# EAGLE schematic layout (EAGLE 6.5.0)
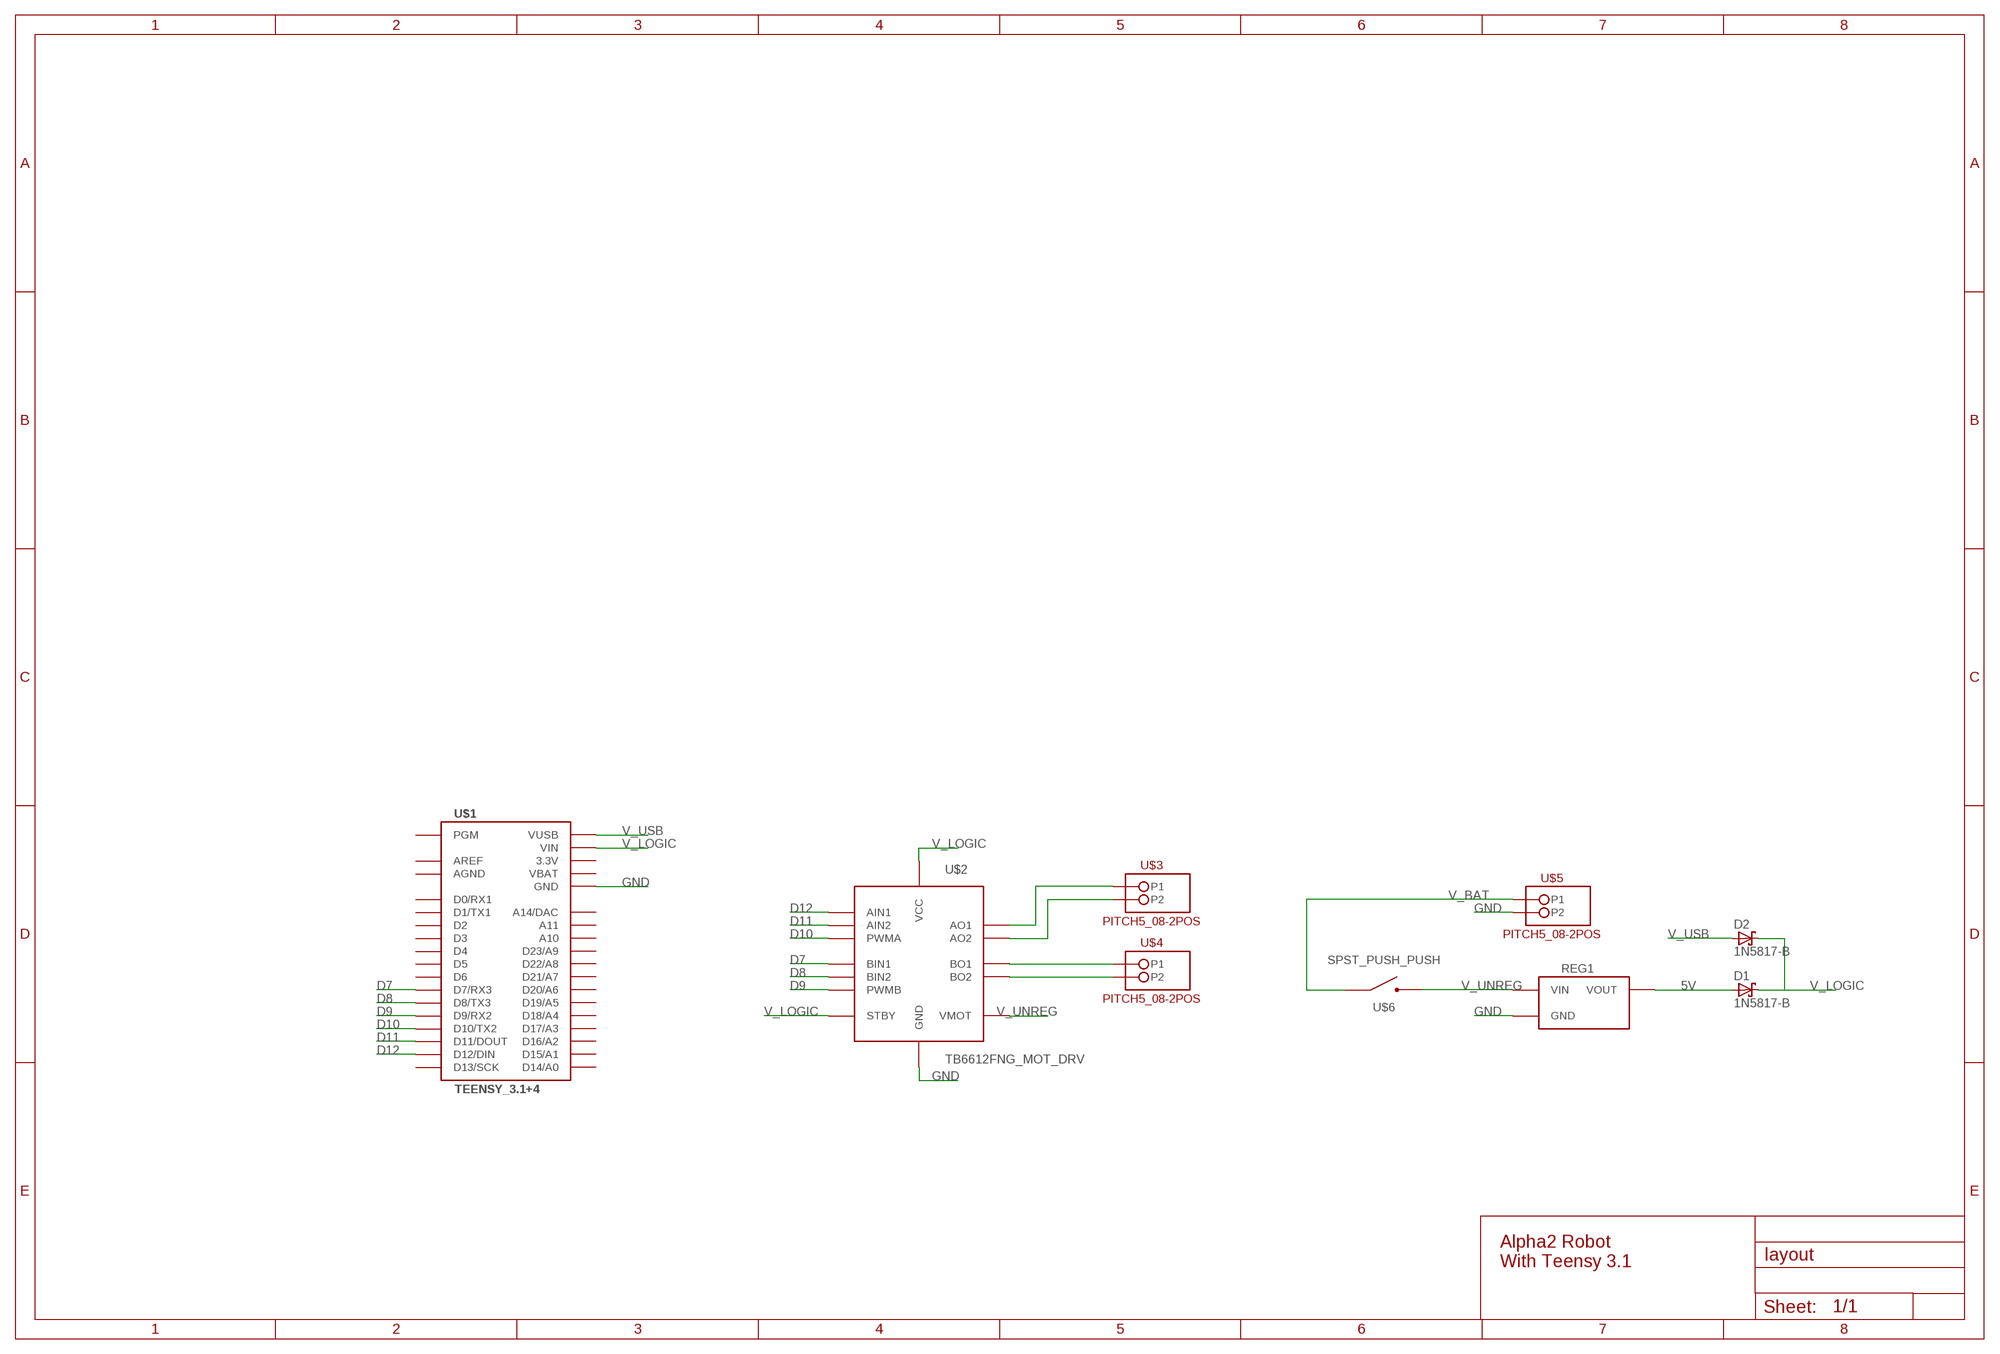
[diagram p0: schematic, sheet 1]

## Parts
D1  1N5817-B  [DO41-7.6]
D2  1N5817-B  [DO41-7.6]
REG1  VREG_POLOLU_2119_5V  [VREG-POLOLU_3PIN]
U$1  TEENSY_3.1+4  [TEENSY_3.1+4]
U$2  TB6612FNG_MOT_DRV  [TB6612FNG]
U$3  PITCH5_08-2POS  [PITCH5_08-2POS]
U$4  PITCH5_08-2POS  [PITCH5_08-2POS]
U$5  PITCH5_08-2POS  [PITCH5_08-2POS]
U$6  SPST_PUSH_PUSH  [SPST_PUSH_PUSH]

## Nets
5V: D1.A REG1.VOUT
D7: U$1.7(D7/RX3) U$2.P$5(BIN1)
D8: U$1.8(D8/TX3) U$2.P$6(BIN2)
D9: U$1.9(D9/RX2) U$2.P$7(PWMB)
D10: U$1.10(D10/TX2) U$2.P$1(PWMA)
D11: U$1.11(D11/DOUT) U$2.P$2(AIN2)
D12: U$1.12(D12/DIN) U$2.P$3(AIN1)
GND: REG1.GND U$1.GND U$1.GND1(GND) U$2.P$8(GND) U$2.P$9(GND) U$2.P$16(GND) U$5.P2
N$1: U$2.P$14(AO1) U$3.P1
N$2: U$2.P$13(AO2) U$3.P2
N$3: U$2.P$12(BO2) U$4.P2
N$4: U$2.P$11(BO1) U$4.P1
V_BAT: U$5.P1 U$6.P1A(P1)
V_LOGIC: D1.C D2.C U$1.VIN U$2.P$4(STBY) U$2.P$15(VCC)
V_UNREG: REG1.VIN U$2.P$10(VMOT) U$6.P2A(P2)
V_USB: D2.A U$1.VUSB
Unconnected: U$1.0(D0/RX1) U$1.1(D1/TX1) U$1.2(D2) U$1.3(D3) U$1.4(D4) U$1.5(D5) U$1.6(D6) U$1.13(D13/SCK) U$1.14/A0(D14/A0) U$1.15/A1(D15/A1) U$1.16/A2(D16/A2) U$1.17/A3(D17/A3) U$1.18/A4(D18/A4) U$1.19/A5(D19/A5) U$1.20/A6(D20/A6) U$1.21/A7(D21/A7) U$1.22/A8(D22/A8) U$1.23/A9(D23/A9) U$1.A10 U$1.A11 U$1.A14/DAC U$1.PGM

## Notes on the sheet
- Alpha2 Robot
  With Teensy 3.1

## Power pins joined to a net without a drawn wire
3.3V: U$1.3.3V U$1.3.3V1(3.3V)
AGND: U$1.AGND
AREF: U$1.AREF
VBAT: U$1.VBAT

## Library data of the parts
D1 D2 = diode:1N581*: 1.0A SCHOTTKY BARRIER RECTIFIER Source: http://www.diodes.com/datasheets/ds23001.pdf
REG1 = InsSys_junk_x:VREG_POLOLU_2119_5V
U$1 = InsSys_teensy:TEENSY_3.1+4: Teensy 3.1 board, showing all thru hole pins. Ports are organized, labled and grouped by digital, analog, serial and SPI.
U$2 = InsSys_misc:TB6612FNG_MOT_DRV
U$3-U$5 = InsSys_screwTerm:PITCH5_08-2POS
U$6 = InsSys_misc:SPST_PUSH_PUSH